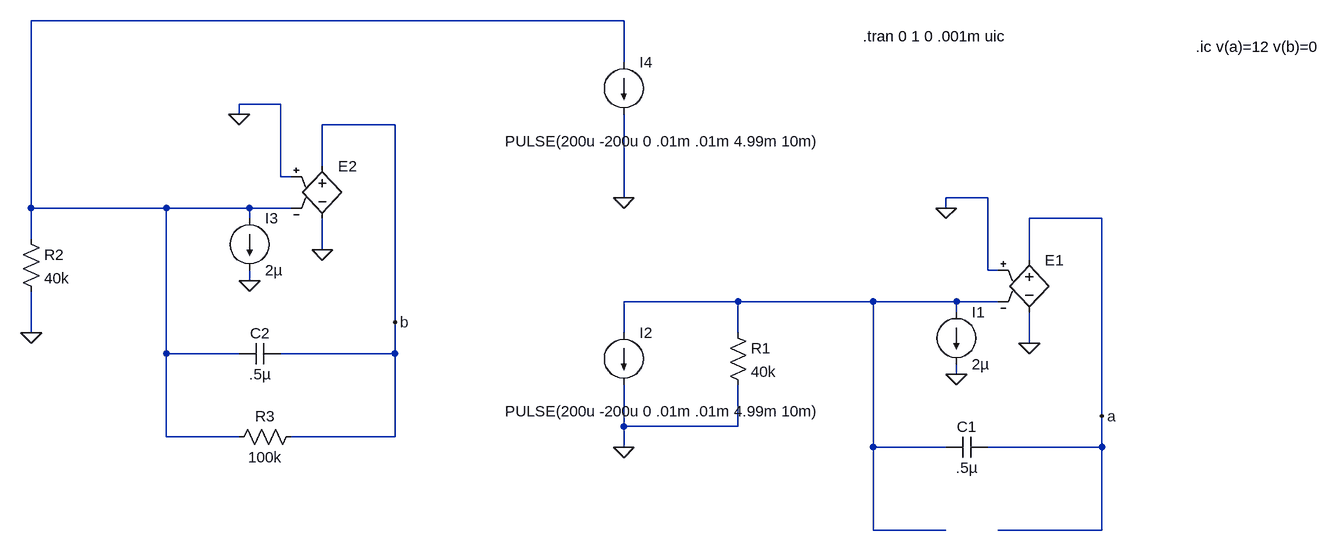
[diagram p0: schematic intideal.asc]
intideal.asc, the LTspice schematic file:
Version 4
SHEET 1 1748 680
WIRE 224 -288 -688 -288
WIRE 224 -224 224 -288
WIRE -304 -160 -368 -160
WIRE -368 -144 -368 -160
WIRE -128 -128 -240 -128
WIRE -240 -64 -240 -128
WIRE -304 -48 -304 -160
WIRE -288 -48 -304 -48
WIRE 224 -16 224 -144
WIRE 784 -16 720 -16
WIRE -688 0 -688 -288
WIRE -480 0 -688 0
WIRE -352 0 -480 0
WIRE -288 0 -352 0
WIRE 720 0 720 -16
WIRE -352 16 -352 0
WIRE 960 16 848 16
WIRE -688 48 -688 0
WIRE -240 64 -240 16
WIRE 848 80 848 16
WIRE 784 96 784 -16
WIRE 800 96 784 96
WIRE -352 112 -352 96
WIRE 400 144 224 144
WIRE 608 144 400 144
WIRE 736 144 608 144
WIRE 800 144 736 144
WIRE 736 160 736 144
WIRE -128 176 -128 -128
WIRE -688 192 -688 128
WIRE 224 192 224 144
WIRE 400 192 400 144
WIRE 848 208 848 160
WIRE -480 224 -480 0
WIRE -368 224 -480 224
WIRE -128 224 -128 176
WIRE -128 224 -304 224
WIRE 736 256 736 240
WIRE 960 320 960 16
WIRE 224 336 224 272
WIRE 400 336 400 272
WIRE 400 336 224 336
WIRE -480 352 -480 224
WIRE -368 352 -480 352
WIRE -128 352 -128 224
WIRE -128 352 -288 352
WIRE 224 368 224 336
WIRE 608 368 608 144
WIRE 720 368 608 368
WIRE 960 368 960 320
WIRE 960 368 784 368
WIRE 608 496 608 368
WIRE 720 496 608 496
WIRE 960 496 960 368
WIRE 960 496 800 496
FLAG 848 208 0
FLAG 224 368 0
FLAG 720 0 0
FLAG 960 320 a
FLAG 736 256 0
FLAG -240 64 0
FLAG -368 -144 0
FLAG -128 176 b
FLAG -352 112 0
FLAG -688 192 0
FLAG 224 -16 0
SYMBOL e 848 64 R0
WINDOW 3 24 96 Invisible 2
SYMATTR Value table=(-100,-12)(-60u,-12)(60u,12)(100,12)
SYMATTR InstName E1
SYMBOL cap 784 352 R90
WINDOW 0 0 32 VBottom 2
WINDOW 3 32 32 VTop 2
SYMATTR InstName C1
SYMATTR Value .5µ
SYMBOL current 736 160 R0
WINDOW 123 0 0 Left 2
WINDOW 39 0 0 Left 2
SYMATTR InstName I1
SYMATTR Value 2µ
SYMBOL current 224 192 R0
WINDOW 3 -183 121 Left 2
WINDOW 123 0 0 Left 2
WINDOW 39 0 0 Left 2
SYMATTR Value PULSE(200u -200u 0 .01m .01m 4.99m 10m)
SYMATTR InstName I2
SYMBOL res 384 176 R0
SYMATTR InstName R1
SYMATTR Value 40k
SYMBOL e -240 -80 R0
WINDOW 3 24 96 Invisible 2
SYMATTR Value table=(-100,-12)(-60u,-12)(60u,12)(100,12)
SYMATTR InstName E2
SYMBOL cap -304 208 R90
WINDOW 0 0 32 VBottom 2
WINDOW 3 32 32 VTop 2
SYMATTR InstName C2
SYMATTR Value .5µ
SYMBOL current -352 16 R0
WINDOW 123 0 0 Left 2
WINDOW 39 0 0 Left 2
SYMATTR InstName I3
SYMATTR Value 2µ
SYMBOL res -704 32 R0
SYMATTR InstName R2
SYMATTR Value 40k
SYMBOL current 224 -224 R0
WINDOW 3 -183 121 Left 2
WINDOW 123 0 0 Left 2
WINDOW 39 0 0 Left 2
SYMATTR Value PULSE(200u -200u 0 .01m .01m 4.99m 10m)
SYMATTR InstName I4
SYMBOL res -272 336 R90
WINDOW 0 0 56 VBottom 2
WINDOW 3 32 56 VTop 2
SYMATTR InstName R3
SYMATTR Value 100k
TEXT 592 -264 Left 2 !.tran 0 1 0 .001m uic
TEXT 1104 -248 Left 2 !.ic v(a)=12 v(b)=0

The netlist it stands for:
* intideal.asc
E1 a 0 0 N002 table=(-100,-12)(-60u,-12)(60u,12)(100,12)
C1 a N002 .5µ
I1 N002 0 2µ
I2 N002 0 PULSE(200u -200u 0 .01m .01m 4.99m 10m)
R1 N002 0 40k
E2 b 0 0 N001 table=(-100,-12)(-60u,-12)(60u,12)(100,12)
C2 b N001 .5µ
I3 N001 0 2µ
R2 N001 0 40k
I4 N001 0 PULSE(200u -200u 0 .01m .01m 4.99m 10m)
R3 b N001 100k
.tran 0 1 0 .001m uic
.ic v(a)=12 v(b)=0
.backanno
.end